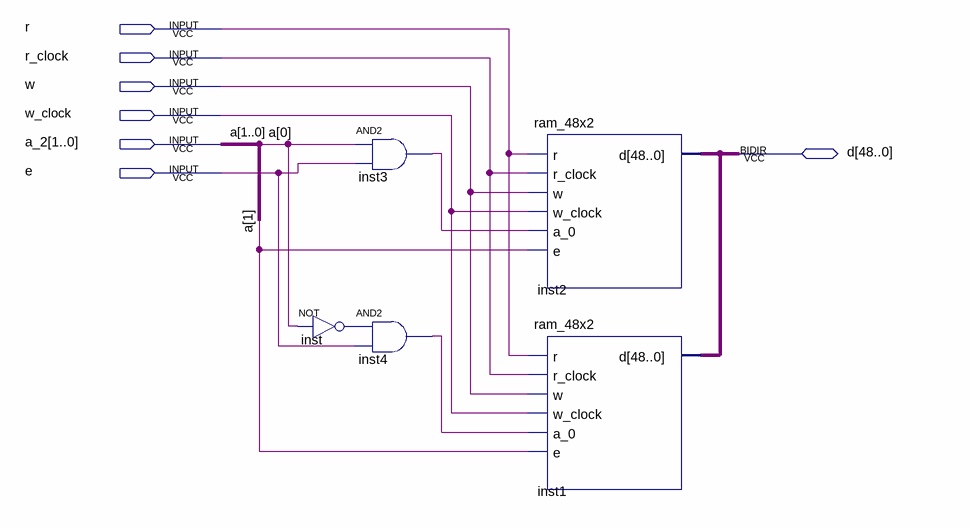
[diagram p0: schematic sheet]
// Quartus schematic ram_48x4.bdf as structural Verilog: 5 symbols, 7 pins
module ram_48x4 (
  input  r,
  input  r_clock,
  input  w,
  input  w_clock,
  input  [1:0] a_2,
  input  e,
  inout  [48:0] d
);

  wire inst3_out, inst4_out, inst_out;

  and inst3 (inst3_out, a_2[0], e);
  not inst (inst_out, a_2[0]);
  and inst4 (inst4_out, inst_out, e);
  ram_48x2 inst2 (.r(r), .r_clock(r_clock), .w(w), .w_clock(w_clock), .a_0(inst3_out), .e(a_2[1]), .d(d));
  ram_48x2 inst1 (.r(r), .r_clock(r_clock), .w(w), .w_clock(w_clock), .a_0(inst4_out), .e(a_2[1]), .d(d));

  // Other names for the same wires on the sheet: a[1:0] = a_2
endmodule
